# EAGLE design mrShark 06 (EAGLE 6.1)

## Sheet 1 of 2
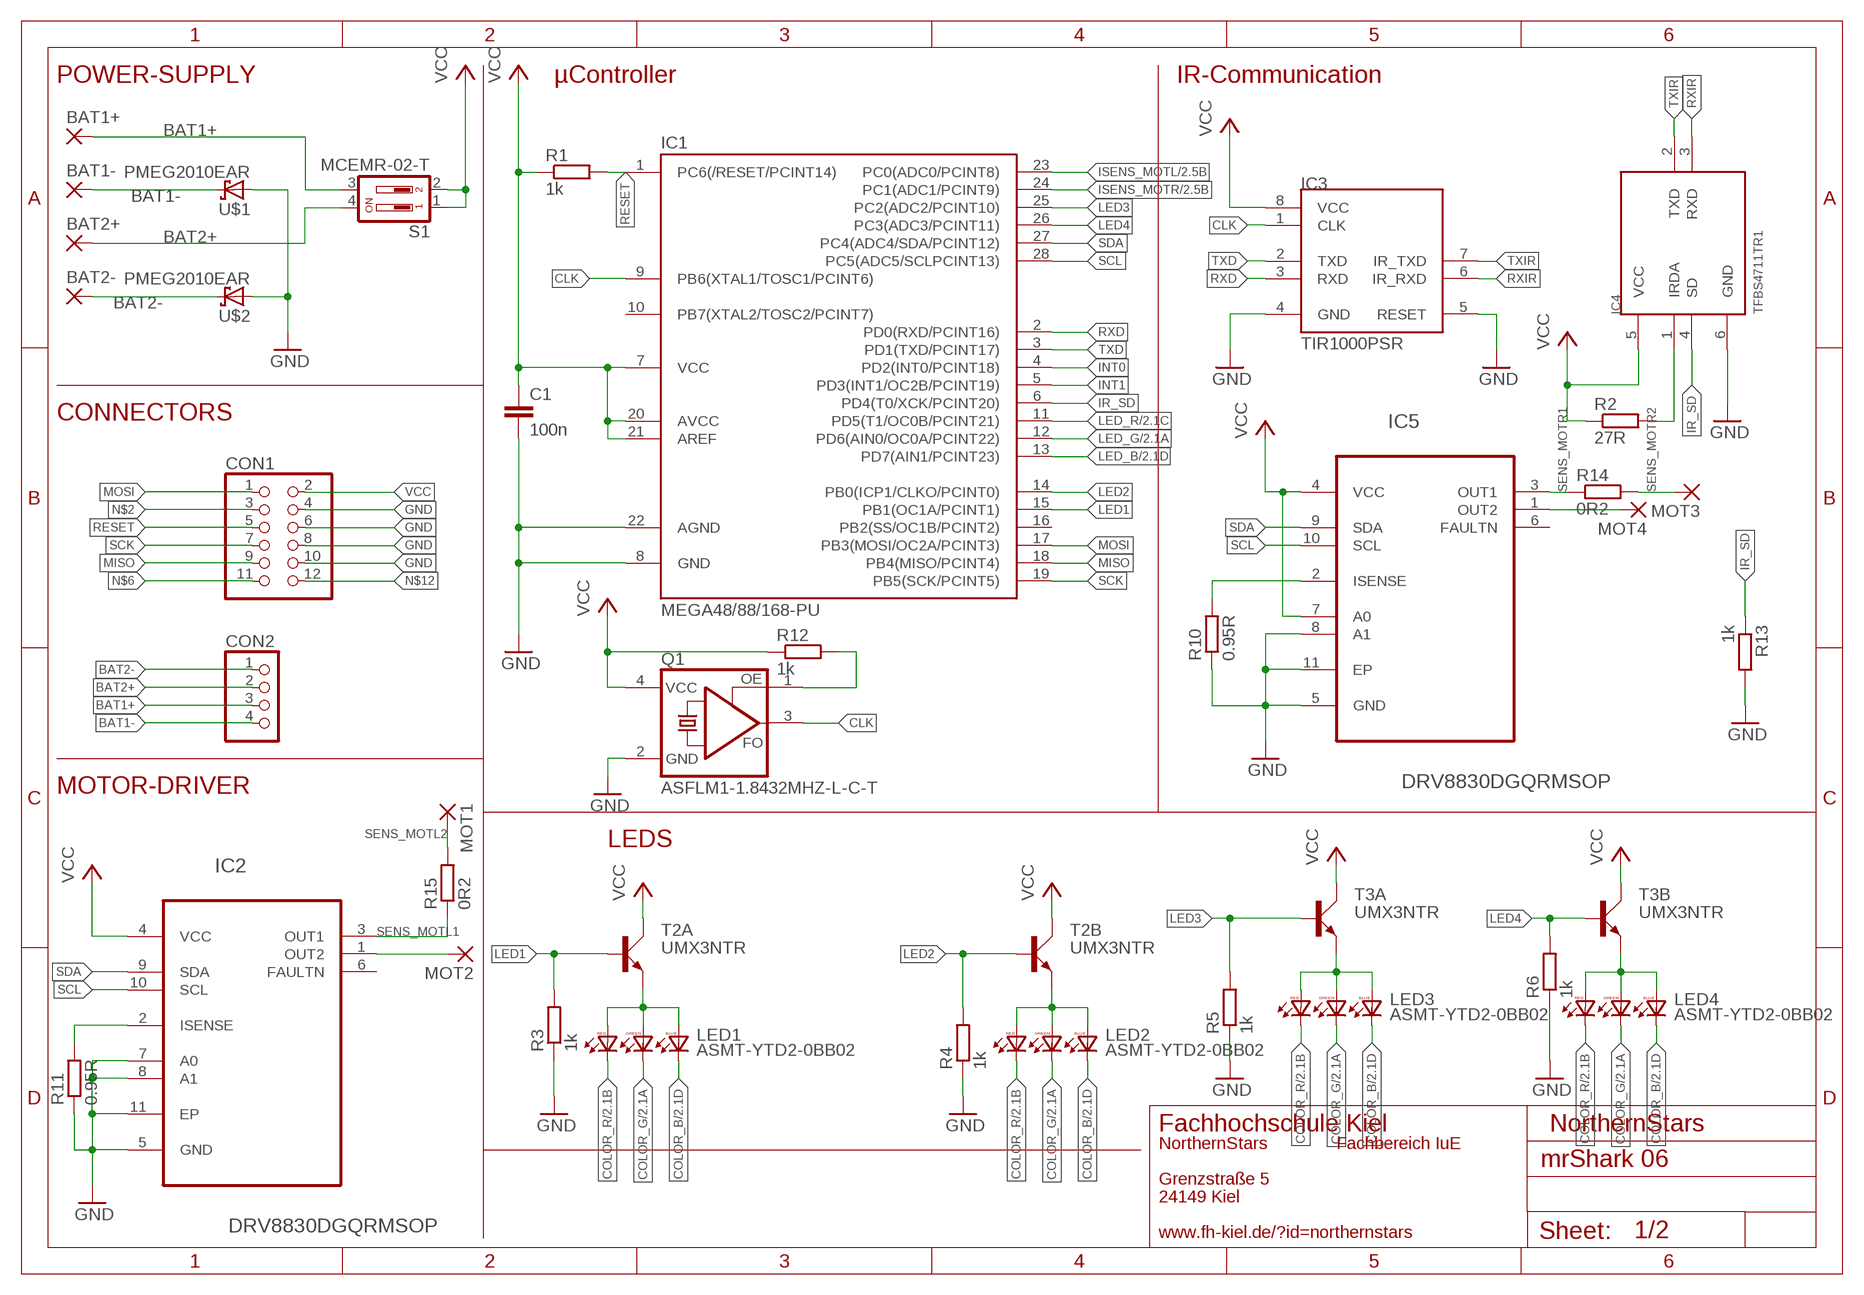
[diagram p0: schematic, sheet 1]

### Parts
BAT1+  1,6/0,9  [1,6/0,9]
BAT1-  1,6/0,9  [1,6/0,9]
BAT2+  1,6/0,9  [1,6/0,9]
BAT2-  1,6/0,9  [1,6/0,9]
C1  100n  C-EUC1206  [C1206]
CON1  PINHD-2X06_2.54-SMD  [2X06SMD]
CON2  PINHD-1X04_2.54-SMD-90°  [1X04SMD/90]
IC1  MEGA48/88/168-PU  [DIL28-3]
IC2  DRV8830DGQRMSOP  [SOP65P640X110-15N]
IC3  TIR1000PSR  [SO-08]
IC4  TFBS4711TR1  [TFBS4711]
IC5  DRV8830DGQRMSOP  [SOP65P640X110-15N]
LED1  ASMT-YTD2-0BB02  PLCC6K  [PLCC6K]
LED2  ASMT-YTD2-0BB02  PLCC6K  [PLCC6K]
LED3  ASMT-YTD2-0BB02  PLCC6K  [PLCC6K]
LED4  ASMT-YTD2-0BB02  PLCC6K  [PLCC6K]
MOT1  1,6/0,9  [1,6/0,9]
MOT2  1,6/0,9  [1,6/0,9]
MOT3  1,6/0,9  [1,6/0,9]
MOT4  1,6/0,9  [1,6/0,9]
Q1  ASFLM1-1.8432MHZ-L-C-T  HC536R  [HC536]
R1  1k  R-EU_R1206  [R1206]
R2  27R  R-EU_R1206  [R1206]
R3  1k  R-EU_R1206  [R1206]
R4  1k  R-EU_R1206  [R1206]
R5  1k  R-EU_R1206  [R1206]
R6  1k  R-EU_R1206  [R1206]
R10  0.95R  R-EU_R1206  [R1206]
R11  0.95R  R-EU_R1206  [R1206]
R12  1k  R-EU_R1206  [R1206]
R13  1k  R-EU_R1206  [R1206]
R14  0R2  R-EU_R0805  [R0805]
R15  0R2  R-EU_R0805  [R0805]
S1  MCEMR-02-T  219-02  [CTS-219-02]
T2  UMX3NTR  UMX3NTR-SOT363  [SOT363_INFINEON]
T3  UMX3NTR  UMX3NTR-SOT363  [SOT363_INFINEON]
U$1  PMEG2010EAR  [SOD323-R]
U$2  PMEG2010EAR  [SOD323-R]

### Nets
BAT1+: BAT1+.1(P) CON2.3 S1.3
BAT1-: BAT1-.1(P) CON2.4 U$1.C
BAT2+: BAT2+.1(P) CON2.2 S1.4
BAT2-: BAT2-.1(P) CON2.1 U$2.C
CLK: IC1.9(PB6(XTAL1/TOSC1/PCINT6)) IC3.1(CLK) Q1.3(FO)
COLOR_B: LED1.1(BC) LED2.1(BC) LED3.1(BC) LED4.1(BC) ; also sheet 2
COLOR_G: LED1.2(GC) LED2.2(GC) LED3.2(GC) LED4.2(GC) ; also sheet 2
COLOR_R: LED1.3(RC) LED2.3(RC) LED3.3(RC) LED4.3(RC) ; also sheet 2
GND: C1.2 CON1.4 CON1.6 CON1.8 CON1.10 IC1.8(GND) IC1.22(AGND) IC2.5(GND) IC2.7(A0) IC2.8(A1) IC2.11(EP) IC3.4(GND) IC3.5(RESET) IC4.6(GND) IC5.5(GND) IC5.8(A1) IC5.11(EP) Q1.2(GND) R3.1 R4.1 R5.1 R6.1 R10.1 R11.1 R13.2 U$1.A U$2.A ; also sheet 2
INT0: IC1.4(PD2(INT0/PCINT18))
INT1: IC1.5(PD3(INT1/OC2B/PCINT19))
IR_SD: IC1.6(PD4(T0/XCK/PCINT20)) IC4.4(SD) R13.1
IRDA: IC4.1(IRDA) R2.2
ISENS_MOTL: IC1.23(PC0(ADC0/PCINT8)) ; also sheet 2
ISENS_MOTR: IC1.24(PC1(ADC1/PCINT9)) ; also sheet 2
LED1: IC1.15(PB1(OC1A/PCINT1)) R3.2 T2.2(A:B)
LED1+: LED1.4(RA) LED1.5(GA) LED1.6(BA) T2.1(A:E)
LED2: IC1.14(PB0(ICP1/CLKO/PCINT0)) R4.2 T2.3(B:B)
LED2+: LED2.4(RA) LED2.5(GA) LED2.6(BA) T2.5(B:E)
LED3: IC1.25(PC2(ADC2/PCINT10)) R5.2 T3.2(A:B)
LED3+: LED3.4(RA) LED3.5(GA) LED3.6(BA) T3.1(A:E)
LED4: IC1.26(PC3(ADC3/PCINT11)) R6.2 T3.3(B:B)
LED4+: LED4.4(RA) LED4.5(GA) LED4.6(BA) T3.5(B:E)
LED_B: IC1.13(PD7(AIN1/PCINT23)) ; also sheet 2
LED_G: IC1.12(PD6(AIN0/OC0A/PCINT22)) ; also sheet 2
LED_R: IC1.11(PD5(T1/OC0B/PCINT21)) ; also sheet 2
MISO: CON1.9 IC1.18(PB4(MISO/PCINT4))
MOSI: CON1.1 IC1.17(PB3(MOSI/OC2A/PCINT3))
N$2: CON1.3
N$3: IC5.1(OUT2) MOT4.1(P)
N$4: Q1.1(OE) R12.2
N$5: IC5.2(ISENSE) R10.2
N$6: CON1.11
N$7: IC2.2(ISENSE) R11.2
N$12: CON1.12
N$16: IC2.1(OUT2) MOT2.1(P)
RESET: CON1.5 IC1.1(PC6(/RESET/PCINT14)) R1.2
RXD: IC1.2(PD0(RXD/PCINT16)) IC3.3(RXD)
RXIR: IC3.6(IR_RXD) IC4.3(RXD)
SCK: CON1.7 IC1.19(PB5(SCK/PCINT5))
SCL: IC1.28(PC5(ADC5/SCLPCINT13)) IC2.10(SCL) IC5.10(SCL)
SDA: IC1.27(PC4(ADC4/SDA/PCINT12)) IC2.9(SDA) IC5.9(SDA)
SENS_MOTL1: IC2.3(OUT1) R15.1 ; also sheet 2
SENS_MOTL2: MOT1.1(P) R15.2 ; also sheet 2
SENS_MOTR1: IC5.3(OUT1) R14.1 ; also sheet 2
SENS_MOTR2: MOT3.1(P) R14.2 ; also sheet 2
TXD: IC1.3(PD1(TXD/PCINT17)) IC3.2(TXD)
TXIR: IC3.7(IR_TXD) IC4.2(TXD)
VCC: C1.1 CON1.2 IC1.7(VCC) IC1.20(AVCC) IC1.21(AREF) IC2.4(VCC) IC3.8(VCC) IC4.5(VCC) IC5.4(VCC) IC5.7(A0) Q1.4(VCC) R1.1 R2.1 R12.1 S1.1 S1.2 T2.4(B:C) T2.6(A:C) T3.4(B:C) T3.6(A:C) ; also sheet 2
Unconnected: IC1.10(PB7(XTAL2/TOSC2/PCINT7)) IC1.16(PB2(SS/OC1B/PCINT2)) IC2.6(FAULTN) IC5.6(FAULTN)

### Notes on the sheet
- POWER-SUPPLY | µController | IR-Communication
- CONNECTORS
- MOTOR-DRIVER
- LEDS
- Fachhochschule Kiel | NorthernStars
- NorthernStars | Fachbereich IuE
- Grenzstraße 5
- 24149 Kiel
- www.fh-kiel.de/?id=northernstars

## Sheet 2 of 2
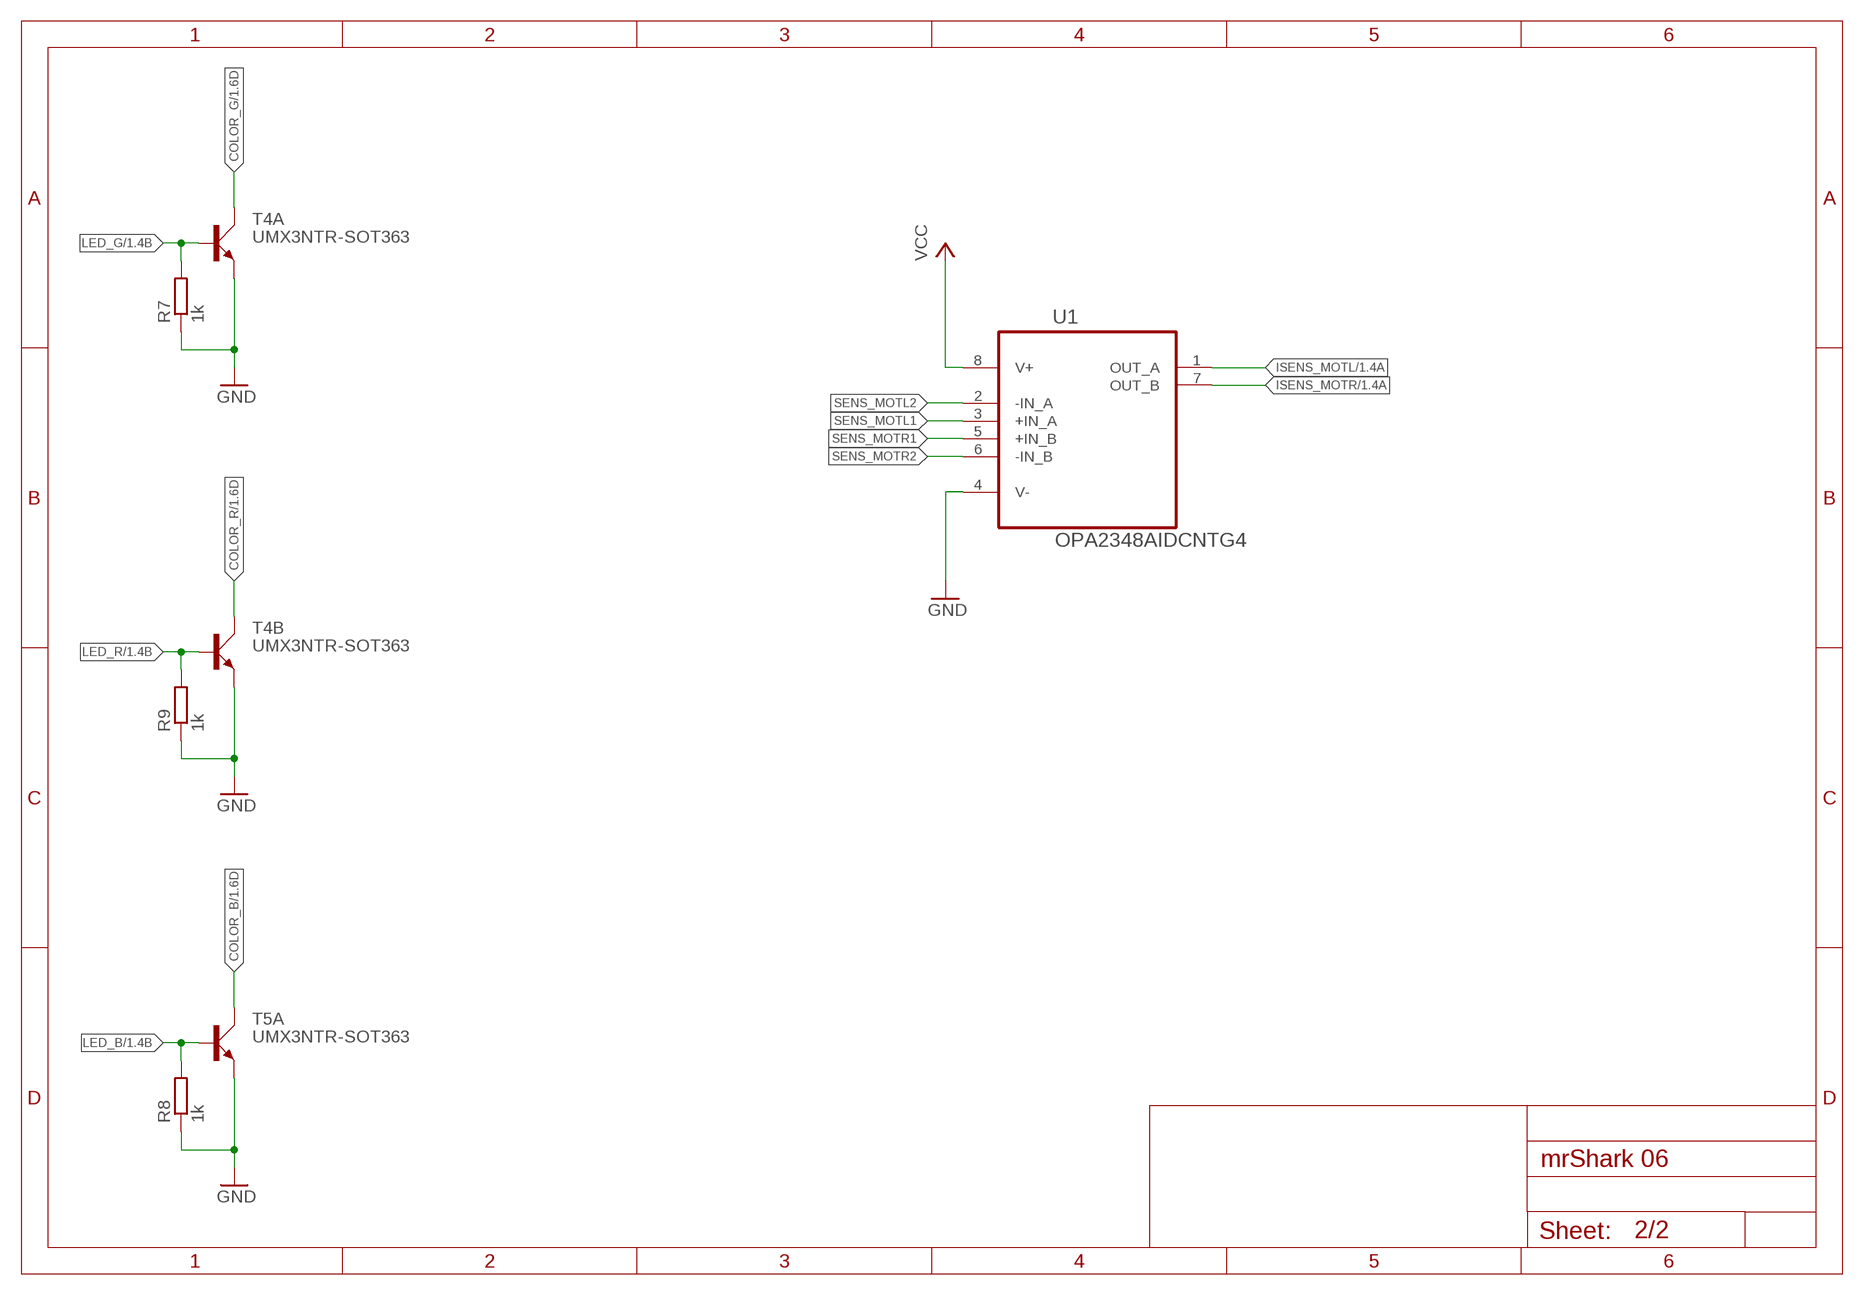
[diagram p1: schematic, sheet 2]

### Parts
R7  1k  R-EU_R1206  [R1206]
R8  1k  R-EU_R1206  [R1206]
R9  1k  R-EU_R1206  [R1206]
T4  UMX3NTR-SOT363  [SOT363_INFINEON]
T5  UMX3NTR-SOT363  [SOT363_INFINEON]
U1  OPA2348AIDCNTG4  [SOT65P280X145-8N]

### Nets
COLOR_B: T5.6(A:C) ; also sheet 1
COLOR_G: T4.6(A:C) ; also sheet 1
COLOR_R: T4.4(B:C) ; also sheet 1
GND: R7.1 R8.1 R9.1 T4.1(A:E) T4.5(B:E) T5.1(A:E) U1.4(V-) ; also sheet 1
ISENS_MOTL: U1.1(OUT_A) ; also sheet 1
ISENS_MOTR: U1.7(OUT_B) ; also sheet 1
LED_B: R8.2 T5.2(A:B) ; also sheet 1
LED_G: R7.2 T4.2(A:B) ; also sheet 1
LED_R: R9.2 T4.3(B:B) ; also sheet 1
SENS_MOTL1: U1.3(+IN_A) ; also sheet 1
SENS_MOTL2: U1.2(-IN_A) ; also sheet 1
SENS_MOTR1: U1.5(+IN_B) ; also sheet 1
SENS_MOTR2: U1.6(-IN_B) ; also sheet 1
VCC: U1.8(V+) ; also sheet 1
Unconnected: T5.3(B:B) T5.4(B:C) T5.5(B:E)

## Library data of the parts
BAT1+ BAT1- BAT2+ BAT2- MOT1-MOT4 = wirepad:1,6/0,9: THROUGH-HOLE PAD
C1 = rcl:C-EU: CAPACITOR, European symbol
CON1 = pinhead-2:PINHD-2X06: PIN HEADER
CON2 = pinhead-2:PINHD-1X04: PIN HEADER
IC1 = avr-6:MEGA48/88/168-PU
IC2 IC5 = texas:DRV8830DGQR: LOW-VOLTAGE MOTOR DRIVER WITH SERIAL INTERFACE; MPN: DRV8830DGQR; OC_FARNELL: 1863106; OC_NEWARK: 58T1482; PACKAGE: MSOP-10; SUPPLIER: TEXAS INSTRUMENTS
IC3 = texas:TIR1000: Texas Instruments TIR1000 STANDALONE IrDATM ENCODER AND DECODER
IC4 = vishay:TFBS4711: TRANSCEIVER IRDA Vishay TFBS4711-TR1 Infrared Transciever 900nm, 600µA, 1m range
LED1-LED4 = led:PLCC6: Standart PLCC6 Package RGB LED
Q1 = crystal:HC536: Crystal HC536R For example: Fox Electronics FOX-HC536R
R1-R15 = rcl:R-EU_: RESISTOR, European symbol
S1 = switch-dil:219-02*: Surface Mount DIP Switch Series 219 SMT CTS Electronic Components Sourc: www.ctscorp.com
T2-T5 = transistor-small-signal:UMX3NTR: DUAL NPN Transistor UMX3NTR Uce = 50V Ic = 150mA Pd = 150mW
U1 = texas:OPA2348AIDCNTG4: OPERATIONAL AMPLIFIERS; MPN: OPA2348AIDCNTG4; OC_FARNELL: 1207098; OC_NEWARK: 97K6805; PACKAGE: SOT23-8; SUPPLIER: Texas Instruments
U$1 U$2 = diode:PMEG2010EA: NXP - Low V F (MEGA) Schottky barrier diode If = 1A, Vr = 20V http://www.farnell.com/datasheets/687996.pdf

## Board
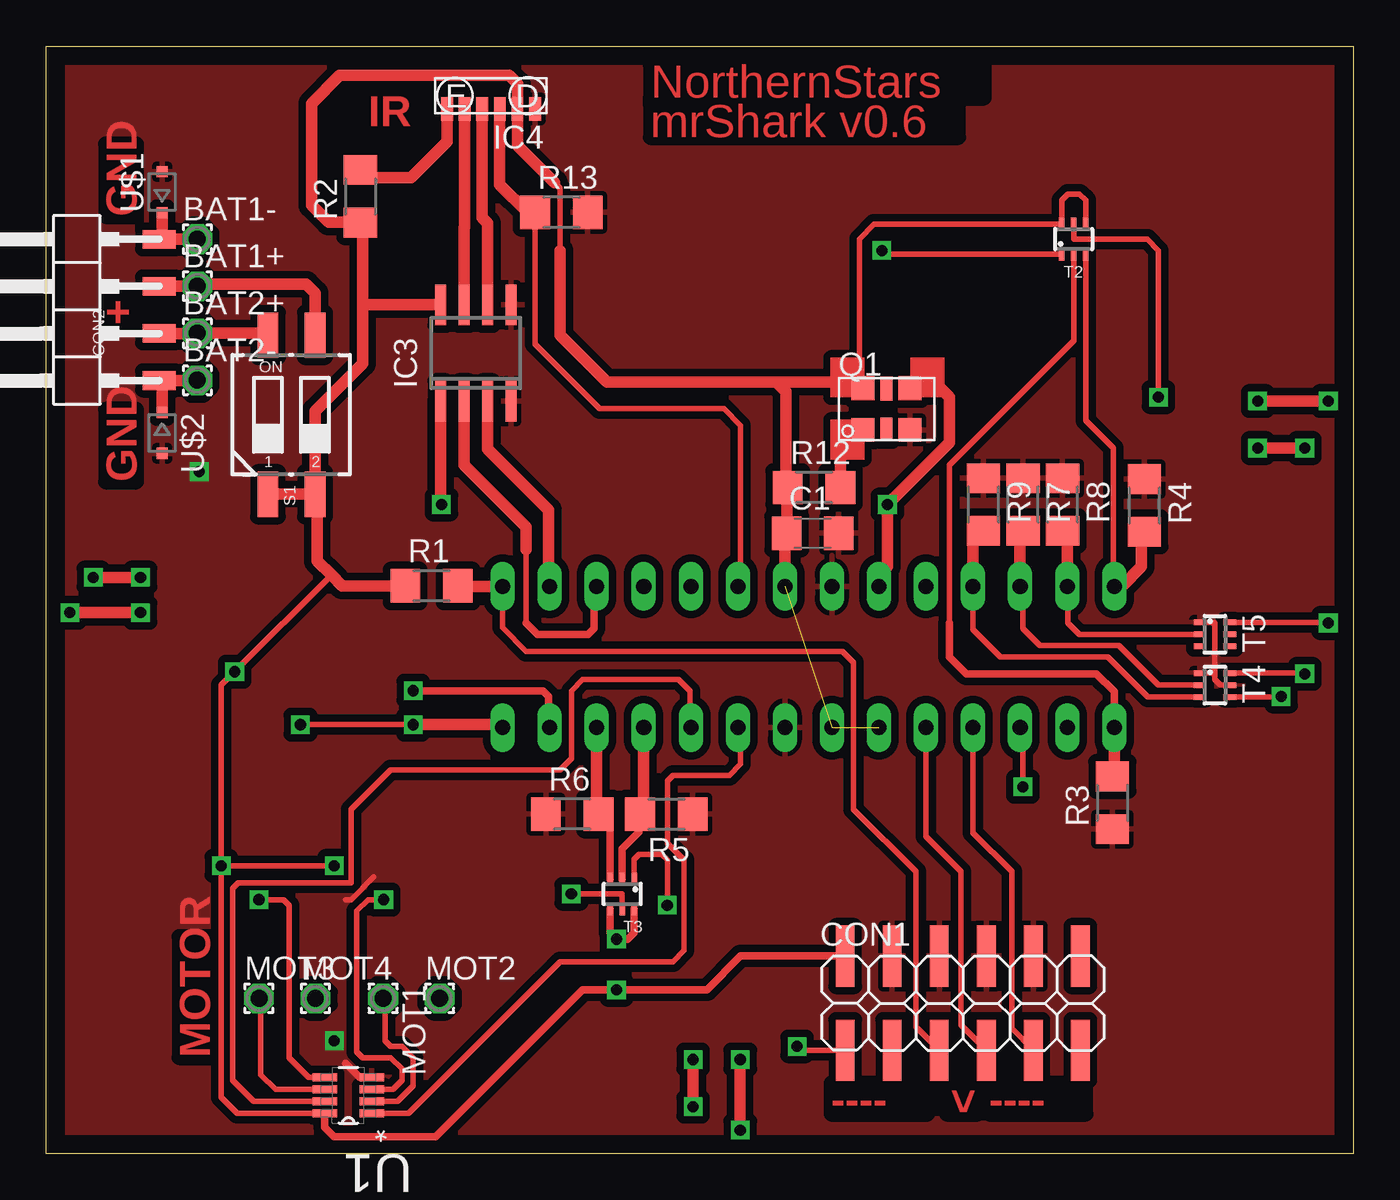
[diagram p2: board, top side]
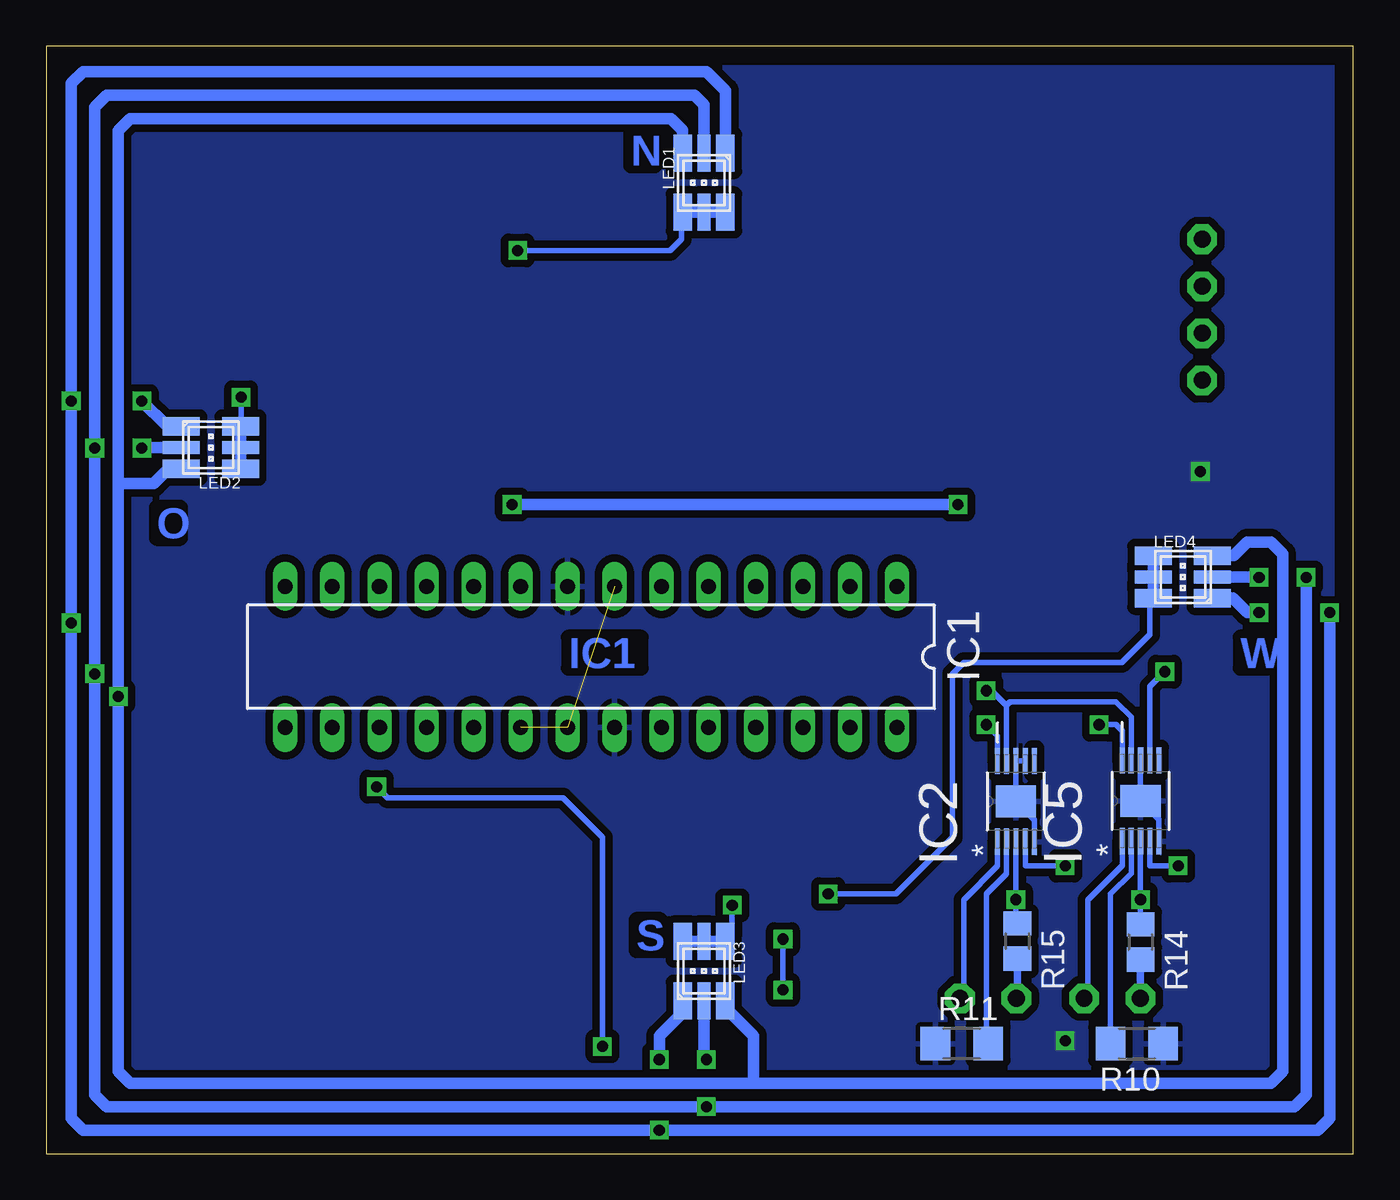
[diagram p3: board, bottom side, seen from below]

Size 70.56 x 59.79 mm. Coordinates in mm from the lower left corner, seen from the top.
Outline: 0,0 0,59.79 70.56,59.79 70.56,0 0,0
Copper layers (1*16): Top 0.035mm / dielectric 1.5mm / Bottom 0.035mm
Design rules: minimum track width 10mil, minimum drill 24mil, track to track 8mil, track to pad 8mil, pad to pad 8mil, via to via 8mil, smd to smd 8mil, copper to edge 40mil, drill to drill 8mil, minimum pad ring 10mil, minimum via ring 8mil, stop-mask expansion 4mil, vias tented up to drill 0mil, thermal gap 10mil

### Footprints (pad centres in the part's own frame; a part is rotated, then mirrored left to right if it is on the bottom)
1,6/0,9 = drill 0.914 pad 1.6 octagon: 1 0,0
C1206 = smd 1.6 x 1.8: 1 -1.4,0; 2 1.4,0
2X06SMD = smd 1.016 x 3.302: 1 -1.27,-3.81; 2 -1.27,1.27; 3 1.27,-3.81; 4 1.27,1.27; 5 3.81,-3.81; 6 3.81,1.27; 7 6.35,-3.81; 8 6.35,1.27; 9 8.89,-3.81; 10 8.89,1.27; 11 11.43,-3.81; 12 11.43,1.27
1X04SMD/90 = smd 1.016 x 1.778: 1 -1.27,-5.08; 2 1.27,-5.08; 3 3.81,-5.08; 4 6.35,-5.08
DIL28-3 = drill 0.813 long: 1 -16.51,-3.81; 2 -13.97,-3.81; 3 -11.43,-3.81; 4 -8.89,-3.81; 5 -6.35,-3.81; 6 -3.81,-3.81; 7 -1.27,-3.81; 8 1.27,-3.81; 9 3.81,-3.81; 10 6.35,-3.81; 11 8.89,-3.81; 12 11.43,-3.81; 13 13.97,-3.81; 14 16.51,-3.81; 15 16.51,3.81; 16 13.97,3.81; 17 11.43,3.81; 18 8.89,3.81; 19 6.35,3.81; 20 3.81,3.81; 21 1.27,3.81; 22 -1.27,3.81; 23 -3.81,3.81; 24 -6.35,3.81; 25 -8.89,3.81; 26 -11.43,3.81; 27 -13.97,3.81; 28 -16.51,3.81
SOP65P640X110-15N = smd 1.422 x 0.279: 1 -2.184,0.991; 2 -2.184,0.508; 3 -2.184,0; 4 -2.184,-0.508; 5 -2.184,-0.991; 6 2.184,-0.991; 7 2.184,-0.508; 8 2.184,0; 9 2.184,0.508; 10 2.184,0.991 | smd 1.727 x 2.184: 11 0,0
SO-08 = smd 0.6 x 2.2: 1 -1.905,-2.6; 2 -0.635,-2.6; 3 0.635,-2.6; 4 1.905,-2.6; 5 1.905,2.6; 6 0.635,2.6; 7 -0.635,2.6; 8 -1.905,2.6
TFBS4711 = smd 0.635 x 1.27: 1 2.37,0.72; 2 1.42,0.72; 3 0.47,0.72; 4 -0.48,0.72; 5 -1.43,0.72; 6 -2.38,0.72
PLCC6K = smd 2 x 1: 1 1.6,-1.15; 3 1.6,1.15; 4 -1.6,1.15; 6 -1.6,-1.15 | smd 2 x 0.7: 2 1.6,0; 5 -1.6,0
HC536 = smd 1.24 x 1.29: 1 -1.27,-1.125; 2 1.27,-1.125; 3 1.27,1.125; 4 -1.27,1.125 | smd 0.64 x 1.29: TP1 0,1.1; TP2 0,-1.1
R1206 = smd 1.6 x 1.803: 1 -1.422,0; 2 1.422,0
R0805 = smd 1.3 x 1.5: 1 -0.95,0; 2 0.95,0
CTS-219-02 = smd 1.13 x 2.44: 1 -1.27,-4.3; 2 1.27,-4.3; 3 1.27,4.3; 4 -1.27,4.3
SOT363_INFINEON = smd 0.3 x 0.7: 1 -0.65,-0.8; 2 0,-0.8; 3 0.65,-0.8; 4 0.65,0.8; 5 0,0.8; 6 -0.65,0.8
SOT65P280X145-8N = smd 1.321 x 0.432: 1 -1.27,0.965; 2 -1.27,0.33; 3 -1.27,-0.33; 4 -1.27,-0.965; 5 1.27,-0.965; 6 1.27,-0.33; 7 1.27,0.33; 8 1.27,0.965
SOD323-R = smd 0.6 x 0.6: A 1.1,0; C -1.1,0

### Placement (x,y rotation side)
BAT1+  8.15,46.84 0 top
BAT1-  8.15,49.38 0 top
BAT2+  8.15,44.3 0 top
BAT2-  8.15,41.76 0 top
C1  41.38,33.5 0 top
CON1  44.4,9.4 0 top
CON2  1.01,43.02 90 top
IC1  41.15,26.82 180 bottom
IC2  18.21,19.02 90 bottom
IC3  23.19,43.23 0 top
IC4  24,57.12 180 top
IC5  11.48,19.05 90 bottom
LED1  35.05,52.43 90 bottom
LED2  61.67,38.13 180 bottom
LED3  35.05,9.86 270 bottom
LED4  9.19,31.14 0 bottom
MOT1  18.19,8.38 270 top
MOT2  21.23,8.38 0 top
MOT3  11.48,8.38 0 top
MOT4  14.53,8.38 0 top
Q1  45.36,40.21 0 top
R1  20.8,30.66 0 top
R2  16.97,51.69 90 top
R3  57.56,18.95 90 top
R4  59.28,35 270 top
R5  33.48,18.34 180 top
R6  28.4,18.34 0 top
R7  52.73,35.05 270 top
R8  54.86,35.05 270 top
R9  50.6,35.05 270 top
R10  11.68,5.94 180 bottom
R11  21.13,5.94 0 bottom
R12  41.45,35.97 0 top
R13  27.81,50.83 0 top
R14  11.48,11.43 270 bottom
R15  18.14,11.48 270 bottom
S1  13.23,39.9 0 top
T2  55.47,49.38 0 top
T3  31.09,14.02 180 top
T4  63.09,25.3 270 top
T5  63.09,28.04 270 top
U1  16.31,3.15 180 top
U$1  6.25,51.92 90 top
U$2  6.25,38.91 270 top

### Tracks (layer width: path | path; a pad name or v marks a point on that pad's centre or on a via)
BAT1+
  Top 0.61: CON2.3 BAT1+.1 8.26,46.94 14.02,46.94 14.5,46.46 S1.3
BAT1-
  Top 0.61: BAT1-.1 CON2.4 6.25,49.52 U$1.C
BAT2+
  Top 0.61: CON2.2 BAT2+.1 11.87,44.3 S1.4
BAT2-
  Top 0.61: BAT2-.1 CON2.1 6.25,41.59 U$2.C
CLK  (via drill 0.6)
  Top 0.61: Q1.3 48.28,41.33 48.77,40.84 48.77,38.41 v45.41,35.05 45.41,31.7 44.96,31.24 IC1.9 | IC3.1 21.29,35.1 v21.34,35.05
  Bottom 0.61: v21.34,35.05 v45.41,35.05
COLOR_B  (via drill 0.6)
  Top 0.305: T5.6 69.17,28.69 v69.22,28.65
  Top 0.61: v65.41,40.64 v69.22,40.64 | v37.47,5.08 v37.47,1.27 | v5.08,29.21 v1.27,29.21
  Bottom 0.61: LED1.1 33.9,57.4 34.92,58.42 68.58,58.42 69.22,57.78 v69.22,40.64 v69.22,28.65 69.22,28.35 69.22,1.91 68.58,1.27 v37.47,1.27 1.91,1.27 1.27,1.91 v1.27,29.21 | LED2.1 64.04,39.27 v65.41,40.64 | LED3.1 36.2,7.61 37.47,6.35 v37.47,5.08 | LED4.1 6.5,29.99 5.71,29.21 v5.08,29.21
COLOR_G  (via drill 0.6)
  Top 0.305: T4.6 67.91,25.95 v67.94,25.91
  Top 0.61: v65.41,38.1 v67.94,38.1 | v34.92,5.08 v34.92,2.54 | v5.08,31.11 v2.54,31.11
  Bottom 0.61: LED1.2 35.05,56.64 35.56,57.15 67.31,57.15 67.94,56.52 v67.94,38.1 67.94,26.52 v67.94,25.91 67.94,3.17 67.31,2.54 v34.92,2.54 3.17,2.54 2.54,3.17 v2.54,31.11 | LED2.2 65.38,38.12 v65.41,38.1 | LED3.2 35.05,5.21 v34.92,5.08 | LED4.2 5.11,31.14 v5.08,31.11
COLOR_R  (via drill 0.6)
  Top 0.305: T4.4 66.64,24.65 v66.67,24.69
  Bottom 0.61: LED1.3 36.2,55.25 36.83,55.88 66.04,55.88 66.67,55.24 66.67,36.2 | 66.67,36.2 v66.67,24.69 66.67,23.77 66.67,4.45 66.04,3.81 32.38,3.81 | 32.38,3.81 4.45,3.81 3.81,4.45 3.81,32.38 4.45,33.02 5.71,33.02 6.45,32.29 LED4.3 | LED2.3 63.99,36.98 64.77,36.2 66.67,36.2 | LED3.3 33.9,7.87 32.38,6.35 32.38,3.81
GND  (via drill 0.6)
  Top 0.305: T5.1 63.05,28.69 63.09,28.65 63.09,25.91 | 63.09,25.91 63.09,25.6 63.4,25.3 T4.5 | T4.1 63.05,25.95 63.09,25.91 | 16.15,13.72 16.46,13.72 17.68,14.94
  Top 0.406: U1.4 16.92,4.12 16.15,4.88
  Bottom 0.305: IC2.7 IC2.8 IC2.11 17.22,18.03 IC2.5 | IC5.8 IC5.11 10.49,18.06 IC5.5
  other vias: 8.26,36.83 15.54,6.1
  pour Top (isolate 0.406): 0,0 0,59.69 70.48,59.69 70.48,0
  pour Bottom (isolate 0.406): 0,0 0,59.69 70.48,59.69 70.48,0
IR_SD
  Top 0.305: R13.1 26.39,43.71 29.87,40.23 36.58,40.23 37.49,39.32 37.49,30.79 IC1.6
  Top 0.61: IC4.4 24.48,52.33 25.98,50.83 R13.1
IRDA
  Top 0.61: IC4.1 21.63,54.65 19.68,52.7 17.37,52.7 R2.2
ISENS_MOTL
  Top 0.305: U1.1 19.56,2.18 27.74,10.36 33.83,10.36 34.44,10.97 34.44,15.85 33.53,16.76 33.53,20.12 33.83,20.42 36.88,20.42 37.49,21.03 37.49,22.86 IC1.23
ISENS_MOTR
  Top 0.305: U1.7 11.2,2.82 10.06,3.96 10.06,14.33 10.36,14.63 16.46,14.63 16.46,18.59 18.59,20.73 27.74,20.73 28.35,21.34 28.35,24.99 28.96,25.6 34.14,25.6 34.75,24.99 34.75,23.06 IC1.24
LED1
  Top 0.305: 48.77,28.65 48.77,37.19 55.47,43.89 T2.2
  Top 0.406: IC1.15 57.66,24.94 56.69,25.91 49.68,25.91 48.77,26.82 48.77,28.65
  Top 0.61: IC1.15 57.66,20.47 R3.2
LED1+  (via drill 0.6)
  Top 0.305: T2.1 45.3,48.58 v45.11,48.77
  Bottom 0.305: v45.11,48.77 36.88,48.77 36.27,49.38 36.27,50.76 LED1.4
  Bottom 0.61: LED1.6 LED1.5 LED1.4
LED2
  Top 0.305: T2.3 56.12,39.58 57.61,38.1 57.61,30.68 IC1.14
  Top 0.61: 57.61,30.68 58.12,30.68 59.13,31.7 59.13,33.43 R4.2
LED2+  (via drill 0.6)
  Top 0.305: T2.5 55.47,49.38 59.44,49.38 60.05,48.77 v60.05,40.84
  Bottom 0.305: v60.05,40.84 60.05,39.3 LED2.6
  Bottom 0.61: LED2.6 LED2.5 LED2.4
LED3
  Top 0.406: T3.2 31.09,16.46 32,17.37 32,18.29 R5.2
  Top 0.61: IC1.25 32.26,18.54 R5.2
LED3+  (via drill 0.6)
  Top 0.305: T3.1 31.74,15.89 32,16.15 33.22,16.15 33.53,15.85 v33.53,13.41
  Bottom 0.305: v33.53,13.41 33.53,11.83 LED3.4
  Bottom 0.61: LED3.4 LED3.5 LED3.6
LED4
  Top 0.406: T3.3 30.44,17.72 R6.2
  Top 0.61: IC1.26 29.72,18.44 R6.2
LED4+  (via drill 0.6)
  Top 0.305: T3.5 31.09,14.02 v28.35,14.02
  Bottom 0.305: v28.35,14.02 24.69,14.02 21.64,17.07 21.64,25.91 21.03,26.52 12.5,26.52 10.97,28.04 10.97,29.81 LED4.6
  Bottom 0.61: LED4.4 LED4.5 LED4.6
LED_B
  Top 0.305: T5.2 55.78,28.04 55.17,28.65 55.17,30.58 IC1.13
  Top 0.61: IC1.13 55.12,33.27 R8.2
LED_G
  Top 0.305: T4.2 60.05,25.3 57.91,27.43 53.65,27.43 52.73,28.35 52.73,30.48 IC1.12
  Top 0.61: IC1.12 52.58,33.17 R7.2
LED_R
  Top 0.305: IC1.11 50.04,28.3 51.51,26.82 57.3,26.82 59.48,24.65 T4.3
  Top 0.61: IC1.11 50.04,33.07 R9.2
MISO
  Top 0.305: IC1.18 50.04,17.32 52.12,15.24 52.12,6.76 CON1.9
MOSI  (via drill 0.6)
  Top 0.305: CON1.1 40.74,5.59 v40.54,5.79 | v52.73,19.81 52.73,22.86 IC1.17
  Bottom 0.305: v40.54,5.79 40.54,17.07 42.67,19.2 52.12,19.2 v52.73,19.81
N$3
  Bottom 0.305: IC5.1 12.47,15.57 14.33,13.72 14.33,8.59 MOT4.1
N$4
  Top 0.61: R12.2 42.88,37.86 Q1.1
N$5
  Bottom 0.305: R10.2 13.11,14.02 11.99,15.14 IC5.2 | R10.2
N$7
  Bottom 0.305: R11.2 19.81,6.04 19.81,14.02 18.72,15.11 IC2.2
N$16
  Bottom 0.305: IC2.1 19.2,15.54 21.03,13.72 21.03,8.59 MOT2.1
RESET
  Top 0.305: IC1.1 24.64,28.4 25.91,27.13 42.98,27.13 43.59,26.52 43.59,18.59 46.94,15.24 46.94,6.86 CON1.5
  Top 0.61: IC1.1 22.25,30.63 R1.2
RXD
  Top 0.61: IC3.3 23.82,38.05 27.13,34.75 27.13,30.68 IC1.2
RXIR
  Top 0.61: IC3.6 23.82,50.24 23.53,50.53 IC4.3
SCK
  Top 0.305: IC1.19 47.5,17.12 49.38,15.24 49.38,6.96 CON1.7
SCL  (via drill 0.6)
  Top 0.305: v13.72,23.16 v19.81,23.16
  Top 0.61: v19.81,23.16 24.49,23.16 IC1.28
  Bottom 0.305: IC2.10 19.2,22.55 v19.81,23.16 | IC5.10 12.47,22.84 12.8,23.16 v13.72,23.16
SDA  (via drill 0.6)
  Top 0.406: v19.81,24.99 26.82,24.99 27.13,24.69 27.13,23.06 IC1.27
  Bottom 0.305: IC2.9 18.72,24.21 | IC5.9 11.99,23.57 12.8,24.38 18.54,24.38 18.72,24.21 | 18.72,24.21 19.51,24.99 v19.81,24.99
SENS_MOTL1  (via drill 0.6)
  Top 0.305: U1.3 18.72,3.48 19.2,3.96 19.2,4.57 18.59,5.18 17.07,5.18 16.76,5.49 16.76,13.11 17.37,13.72 v18.21,13.72
  Bottom 0.305: IC2.3 18.21,14.02 v18.21,13.72 18.21,12.51 R15.1
SENS_MOTL2
  Top 0.305: U1.2 18.97,2.82 19.81,3.66 19.81,5.18 19.2,5.79 18.59,5.79 18.29,6.1 18.29,8.28 MOT1.1
  Bottom 0.406: R15.2 18.14,8.43 MOT1.1
SENS_MOTR1  (via drill 0.6)
  Top 0.305: U1.5 14.17,4.12 13.11,5.18 13.11,13.41 12.8,13.72 v11.48,13.72
  Bottom 0.305: IC5.3 v11.48,13.72 11.48,13.41 R14.1
SENS_MOTR2
  Top 0.305: U1.6 12.37,3.48 11.58,4.27 11.58,8.28 MOT3.1
  Bottom 0.406: R14.2 MOT3.1
TXD
  Top 0.305: 25.91,32.61 25.91,28.65
  Top 0.406: 25.91,28.65 26.52,28.04 29.26,28.04 29.57,28.35 29.57,30.48 IC1.3
  Top 0.61: IC3.2 22.55,37.19 25.91,33.83 25.91,32.61
TXIR
  Top 0.61: IC4.2 22.58,50.02 22.55,49.99 IC3.7
VCC  (via drill 0.6)  (2 unrouted)
  Top 0.305: 27.43,52.43 27.74,52.12 27.74,48.77 | v9.45,15.54 v15.54,15.54 | v9.45,15.54 9.45,25.3 v10.17,26.02 15.39,31.24 | U1.8 10.31,2.18 9.45,3.05 v9.45,15.54 | T2.4 56.12,51.47 55.78,51.82 55.17,51.82 54.82,51.47 T2.6 44.69,50.18 43.89,49.38 43.89,41.54 Q1.4
  Top 0.406: U1.8 15.04,1.42 15.54,0.91 21.03,0.91 28.96,8.84 v30.79,8.84 35.66,8.84 37.49,10.67 CON1.2 | T3.4 30.44,11.93 v30.79,11.58 31.39,11.58 31.74,11.93 T3.6
  Top 0.61: S1.1 S1.2 | S1.2 14.5,40.11 17.07,42.67 17.07,45.72 | 17.07,45.72 17.07,50.16 R2.1 16.94,50.29 15.24,50.29 14.33,51.21 14.33,56.69 15.85,58.22 24.99,58.22 25.43,57.78 IC4.5 25.43,54.42 27.43,52.43 | IC3.8 17.18,45.83 17.07,45.72 | R1.1 15.98,30.66 15.39,31.24 14.63,32 14.63,35.48 S1.2 | Q1.4 43.77,41.66 39.42,41.66 | 27.74,48.77 27.74,44.2 30.28,41.66 39.42,41.66 | IC1.7 39.88,33.4 C1.1 39.98,35.91 R12.1 39.93,36.07 39.93,41.15 39.42,41.66
  Bottom 0.305: IC5.4 10.97,15.54 v9.45,15.54 | IC2.4 17.7,15.57 17.68,15.54 v15.54,15.54 | v30.79,11.58 v30.79,8.84 | IC5.7 10.97,25.22 v10.17,26.02
(copper drawn outside any net)
  shapes: Top area x3

### Text on the board
Top: NorthernStars | IR | mrShark v0.6 | GND | + | GND | MOTOR | ---- | < | ----
Bottom: N | O | W | IC1 | S